# Altium schematic sheet Feedback_Controller_Buck.SchDoc: Buck Converter 20V 60W
size A4; Date: 25 FEB 2024; Author: Arturo S. Bayangos; Revision: V.10; SheetNumber: 3; SheetTotal: 4
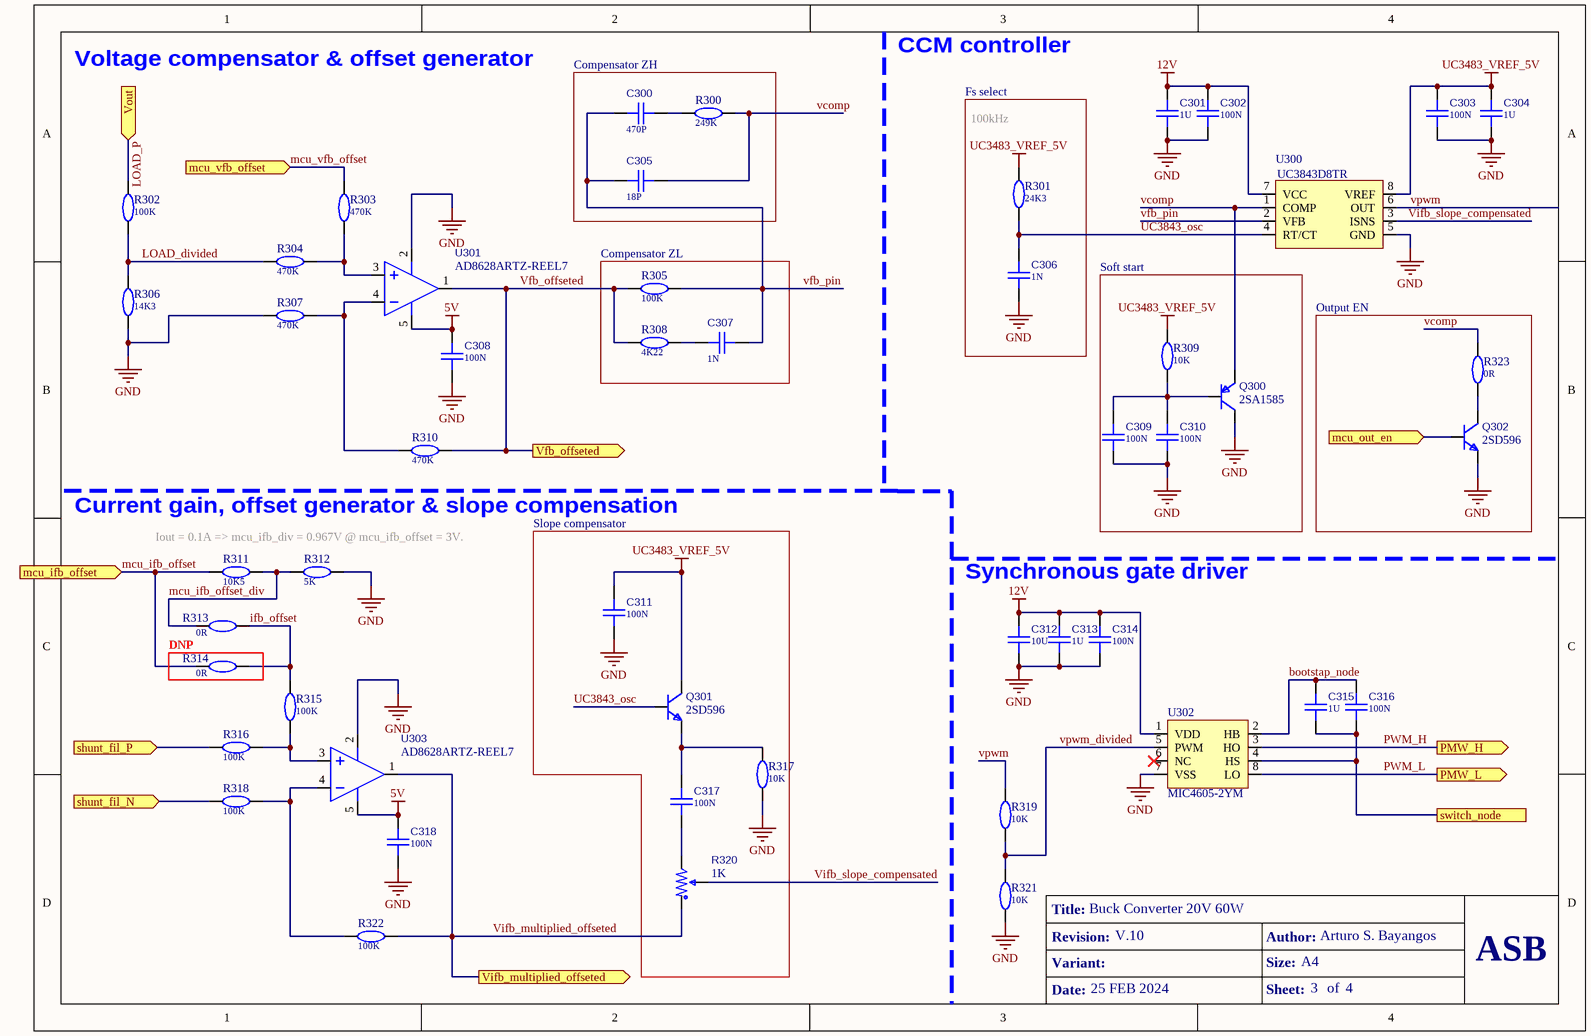
[diagram p0: Feedback_Controller_Buck.SchDoc]

## Parts
C300  value 470P  [CAP_0603]  (hidden comment: CAPACITOR)
C301  value 1U  [CAP_0603]  (hidden comment: CAPACITOR)
C302  value 100N  [CAP_0402]  (hidden comment: CAPACITOR)
C303  value 100N  [CAP_0402]  (hidden comment: CAPACITOR)
C304  value 1U  [CAP_0603]  (hidden comment: CAPACITOR)
C305  value 18P  [CAP_0603]  (hidden comment: CAPACITOR)
C306  value 1N  [CAP_0603]  (hidden comment: CAPACITOR)
C307  value 1N  [CAP_0603]  (hidden comment: CAPACITOR)
C308  value 100N  [CAP_0402]  (hidden comment: CAPACITOR)
C309  value 100N  [CAP_0402]  (hidden comment: CAPACITOR)
C310  value 100N  [CAP_0402]  (hidden comment: CAPACITOR)
C311  value 100N  [CAP_0402]  (hidden comment: CAPACITOR)
C312  value 10U  [CAP_1210]  (hidden comment: CAPACITOR)
C313  value 1U  [CAP_0603]  (hidden comment: CAPACITOR)
C314  value 100N  [CAP_0402]  (hidden comment: CAPACITOR)
C315  value 1U  [CAP_0603]  (hidden comment: CAPACITOR)
C316  value 100N  [CAP_0402]  (hidden comment: CAPACITOR)
C317  value 100N  [CAP_0402]  (hidden comment: CAPACITOR)
C318  value 100N  [CAP_0402]  (hidden comment: CAPACITOR)
Q300  value 2SA1585  [SOT-23]  (hidden comment: BJT_PNP)
Q301  value 2SD596  [SOT-23]  (hidden comment: BJT_NPN)
Q302  value 2SD596  [SOT-23]  (hidden comment: BJT_NPN)
R300  value 249K  [RES_0603]  (hidden comment: RESISTOR)
R301  value 24K3  [RES_0603]  (hidden comment: RESISTOR)
R302  value 100K  [RES_0603]  (hidden comment: RESISTOR)
R303  value 470K  [RES_0603]  (hidden comment: RESISTOR)
R304  value 470K  [RES_0603]  (hidden comment: RESISTOR)
R305  value 100K  [RES_0603]  (hidden comment: RESISTOR)
R306  value 14K3  [RES_0603]  (hidden comment: RESISTOR)
R307  value 470K  [RES_0603]  (hidden comment: RESISTOR)
R308  value 4K22  [RES_0603]  (hidden comment: RESISTOR)
R309  value 10K  [RES_0603]  (hidden comment: RESISTOR)
R310  value 470K  [RES_0603]  (hidden comment: RESISTOR)
R311  value 10K5  [RES_0402]  (hidden comment: RESISTOR)
R312  value 5K  [RES_0402]  (hidden comment: RESISTOR)
R313  value 0R  [RES_0402]  (hidden comment: RESISTOR)
R314  value 0R  [RES_0402]  (hidden comment: RESISTOR)
R315  value 100K  [RES_0603]  (hidden comment: RESISTOR)
R316  value 100K  [RES_0603]  (hidden comment: RESISTOR)
R317  value 10K  [RES_0603]  (hidden comment: RESISTOR)
R318  value 100K  [RES_0603]  (hidden comment: RESISTOR)
R319  value 10K  [RES_0603]  (hidden comment: RESISTOR)
R320  value 1K  [RES_GF063P1-B102]  (hidden comment: RESISTOR_POT)
R321  value 10K  [RES_0603]  (hidden comment: RESISTOR)
R322  value 100K  [RES_0603]  (hidden comment: RESISTOR)
R323  value 0R  [RES_0402]  (hidden comment: RESISTOR)
U300  value UC3843D8TR  [SOIC-8]  (hidden comment: PWM-CONTROLLER_8P)
U301  value AD8628ARTZ-REEL7  [SOT-23-5]  (hidden comment: OPAMP_1)
U302  value MIC4605-2YM  [SOIC-8]  (hidden comment: GATEDRIVE_8P_SINGLE-PWM)
U303  value AD8628ARTZ-REEL7  [SOT-23-5]  (hidden comment: OPAMP_1)

## Blocks framed on the sheet
Compensator ZH: C300 C305 R300
Compensator ZL: C307 R305 R308
Soft start: C309 C310 Q300 R309
Output EN: Q302 R323
Slope compensator: C311 C317 Q301 R317 R320

## Ports
mcu_ifb_offset (in), mcu_out_en (in), mcu_vfb_offset (in), PMW_H (out), PMW_L (out), shunt_fil_N (in), shunt_fil_P (in), switch_node, Vfb_offseted (out), Vifb_multiplied_offseted (out), Vout (in)

## Nets
5V: C308.2 C318.2 U301.5(+V) U303.5(+V)
12V: C301.2 C302.2 C312.2 C313.1 C314.2 U300.7(VCC) U302.1(VDD)
GND: C301.1 C302.1 C303.1 C304.1 C306.2 C308.1 C309.1 C310.1 C311.1 C312.1 C313.2 C314.1 C318.1 Q300.3(C) Q302.2(E) R306.1 R307.1 R312.2 R317.1 R321.1 U300.5(GND) U301.2(-V) U302.7(VSS) U303.2(-V)
UC3483_VREF_5V: C303.2 C304.2 C311.2 Q301.3(C) R301.2 R309.2 U300.8(VREF)
bootstap_node: C315.2 C316.1 U302.2(HB)
ifb_offset: R313.2 R314.2 R315.2
LOAD_divided: R302.1 R304.1 R306.2
LOAD_P: R302.2 ; port Vout
mcu_ifb_offset: R311.1 R314.1 ; port mcu_ifb_offset
mcu_ifb_offset_div: R311.2 R312.1 R313.1
mcu_out_en: Q302.1(B) ; port mcu_out_en
mcu_vfb_offset: R303.2 ; port mcu_vfb_offset
PWM_H: U302.3(HO) ; port PMW_H
PWM_L: U302.8(LO) ; port PMW_L
shunt_fil_N: R318.1 ; port shunt_fil_N
shunt_fil_P: R316.1 ; port shunt_fil_P
switch_node: C315.1 C316.2 U302.4(HS) ; port switch_node
UC3843_osc: C306.1 Q301.1(B) R301.1 U300.4(RT/CT)
vcomp: C305.2 Q300.2(E) R300.2 R323.2 U300.1(COMP)
Vfb_offseted: R305.1 R308.1 R310.2 U301.1(OUT) ; port Vfb_offseted
vfb_pin: C300.1 C305.1 C307.2 R305.2 U300.2(VFB)
Vifb_multiplied_offseted: R320.1 R322.2 U303.1(OUT) ; port Vifb_multiplied_offseted
Vifb_slope_compensated: R320.2 U300.3(ISNS)
vpwm: R319.2 U300.6(OUT)
vpwm_divided: R319.1 R321.2 U302.5(PWM)
NetC300_2: C300.2 R300.1
NetC307_1: C307.1 R308.2
NetC309_2: C309.2 C310.2 Q300.1(B) R309.1
NetC317_1: C317.1 R320.3
NetC317_2: C317.2 Q301.2(E) R317.2
NetQ302_3: Q302.3(C) R323.1
NetR303_1: R303.1 R304.2 U301.3(+IN)
NetR307_2: R307.2 R310.1 U301.4(-IN)
NetR315_1: R315.1 R316.2 U303.3(+IN)
NetR318_2: R318.2 R322.1 U303.4(-IN)

Not connected (* = marked no-connect by the designer): U302 6(NC)*

## Notes on the sheet
- Voltage compensator & offset generator
- CCM controller
- Fs select
- 100kHz
- Current gain, offset generator & slope compensation
- Iout = 0.1A => mcu_ifb_div = 0.967V @ mcu_ifb_offset = 3V.
- Synchronous gate driver
- DNP
- Title:
- Revision:
- Variant:
- Size:
- Author:
- A4
- ASB
- Date:
- Sheet:
- of

## Library data of the parts
C300 = CC0603GRNPO9BN471: CAP 470P 0603 NPO 50V 2%; Manifacturer: YAGEO; Part Number: CC0603GRNPO9BN471; ComponentLink1Description: Datasheet; ComponentLink1URL: https://datasheet.lcsc.com/lcsc/2304140030_YAGEO-CC0603GRNPO9BN471_C327194.pdf; ComponentLink2Description: Characteristics; Package: 0603
C301 C304 C313 C315 = TMK107AB7105KAHT: CAP 1U 0603 X7R 25V 10%; Manifacturer: Taiyo Yuden; Part Number: TMK107AB7105KAHT; ComponentLink1Description: Datasheet; ComponentLink1URL: https://datasheet.lcsc.com/lcsc/1912111437_Taiyo-Yuden-TMK107AB7105KAHT_C386079.pdf; ComponentLink2Description: Characteristics; ComponentLink2URL: Datasheets\Capacitors\TMK107AB7105KAHT_TaiyoYuden.pdf; Package: 0603
C302 C303 C308-C311 C314 C316-C318 = UMK105B7104KV-FR: CAP 100N 0402 X7R 50V 10%; Manifacturer: Taiyo Yuden; Part Number: UMK105B7104KV-FR; ComponentLink1Description: Datasheet; ComponentLink1URL: https://datasheet.lcsc.com/lcsc/2211282030_Taiyo-Yuden-UMK105B7104KV-FR_C2167491.pdf; ComponentLink2Description: Characteristics; ComponentLink2URL: Datasheets\Capacitors\UMK105B7104KV-FR_TaiyoYuden.pdf; Package: 0402
C305 = CC0603JRNPO9BN180: CAP 18P 0603 NPO 50V 5%; Manifacturer: YAGEO; Part Number: CC0603JRNPO9BN180; ComponentLink1Description: Datasheet; ComponentLink1URL: https://datasheet.lcsc.com/lcsc/2304140030_YAGEO-CC0603JRNPO9BN180_C107040.pdf; ComponentLink2Description: Characteristics; Package: 0603
C306 C307 = CC0603GRNPO8BN102: CAP 1N 0603 NPO 25V 2%; Manifacturer: YAGEO; Part Number: CC0603GRNPO8BN102; ComponentLink1Description: Datasheet; ComponentLink1URL: https://datasheet.lcsc.com/lcsc/2005181835_YAGEO-CC0603GRNPO8BN102_C519480.pdf; ComponentLink2Description: Characteristics; Package: 0603
C312 = UMK325AB7106KM-T: CAP 10U 1210 X7R 50V 10%; Manifacturer: Taiyo Yuden; Part Number: UMK325AB7106KM-T; ComponentLink1Description: Datasheet; ComponentLink1URL: https://datasheet.lcsc.com/lcsc/2211282230_Taiyo-Yuden-UMK325AB7106KM-T_C386167.pdf; ComponentLink2Description: Characteristics; ComponentLink2URL: Datasheets\Capacitors\UMK325AB7106KM-T_TaiyoYuden_Char.pdf; Package: 1210
Q300 = 2SA1585: PNP 2SA1585 SOT-23 20V 0.35W; VEBO: 6V; Tjmax: 150 °C; Manifacturer: Jiangsu Changjing Electronics Technology Co., Ltd.; Part Number: 2SA1585; Package: SOT-23; VCEO: 20V; Power: 0.35W; ComponentLink1Description: Datasheet; ComponentLink1URL: https://datasheet.lcsc.com/lcsc/1810010514_Jiangsu-Changjing-Electronics-Technology-Co---Ltd--2SA1585_C92477.pdf; ComponentLink2Description: Characteristics
Q301 Q302 = 2SD596: NPN 2SD596 SOT-23 25V 0.2W; VEBO: 5V; Tjmax: 150 °C; Manifacturer: YONGYUTAI; ComponentLink1Description: Datasheet; ComponentLink1URL: https://datasheet.lcsc.com/lcsc/2109011130_YONGYUTAI-2SD596_C2891824.pdf; Part Number: 2SD596; Package: SOT-23; VCEO: 25V; Power: 0.2W
R300 = FRC0603F2493TS: RES 249K 0603 1% 0.1W 75V; Manifacturer: FOJAN; Part Number: FRC0603F2493TS; ComponentLink1Description: Datasheet; ComponentLink1URL: https://datasheet.lcsc.com/lcsc/2308241103_FOJAN-FRC0603F2493TS_C2933177.pdf; ComponentLink2Description: Characteristics; Package: 0603
R301 = WF06H2432BTL: RES 24K3 0603 0.1% 0.1W 50V; Manifacturer: Walsin Tech Corp; Part Number: WF06H2432BTL; ComponentLink1Description: Datasheet; ComponentLink1URL: https://datasheet.lcsc.com/lcsc/2207151730_Walsin-Tech-Corp-WF06H2432BTL_C4354966.pdf; ComponentLink2Description: Characteristics; Package: 0603
R302 R305 R315 R316 R318 R322 = RC0603FR-07100KL: RES 100K 0603 1% 0.1W 75V; Manifacturer: YAGEO; Part Number: RC0603FR-07100KL; ComponentLink1Description: Datasheet; ComponentLink1URL: https://datasheet.lcsc.com/lcsc/1809281124_YAGEO-RC0603FR-07100KL_C14675.pdf; ComponentLink2Description: Characteristics; Package: 0603
R303 R304 R307 R310 = 0603WAF4703T5E: RES 470K 0603 1% 0.1W 75V; Manifacturer: UNI-ROYAL; Part Number: 0603WAF4703T5E; ComponentLink1Description: Datasheet; ComponentLink1URL: https://datasheet.lcsc.com/lcsc/2206010116_UNI-ROYAL-Uniroyal-Elec-0603WAF4703T5E_C23178.pdf; ComponentLink2Description: Characteristics; Package: 0603
R306 = RT0603BRE0714K3L: RES 14K3 0603 1% 0.1W 75V; Manifacturer: YAGEO; Part Number: RT0603BRE0714K3L; ComponentLink1Description: Datasheet; ComponentLink1URL: https://datasheet.lcsc.com/lcsc/2009282136_YAGEO-RT0603BRE0714K3L_C705810.pdf; ComponentLink2Description: Characteristics; Package: 0603
R308 = CRCW06034K22FKEA: RES 4K22 0603 1% 0.1W 75V; Manifacturer: Vishay Intertech; Part Number: CRCW06034K22FKEA; ComponentLink1Description: Datasheet; ComponentLink1URL: https://datasheet.lcsc.com/lcsc/2304140030_Vishay-Intertech-CRCW06034K22FKEA_C843958.pdf; ComponentLink2Description: Characteristics; Package: 0603
R309 R317 R319 R321 = ARG03BTC1002: RES 10K 0603 0.1W 0.1% 75V; Manifacturer: Viking Tech; Part Number: ARG03BTC1002; ComponentLink1Description: Datasheet; ComponentLink1URL: Datasheets\Resistors\ARG03BTC1002_VikingTech.pdf; ComponentLink2Description: Characteristics; Package: 0603
R311 = TC0250B1052TCC: RES 10K5 0402 0.1% 0.625W 25V; Manifacturer: UNI-ROYAL(Uniroyal Elec); Part Number: TC0250B1052TCC; ComponentLink1Description: Datasheet; ComponentLink1URL: https://datasheet.lcsc.com/lcsc/2304140030_UNI-ROYAL-Uniroyal-Elec-TC0250B1052TCC_C517521.pdf; Package: 0402
R312 = AR02BTC5001: RES 5K 0402 0.1% 0.63W; Manifacturer: Viking Tech; Part Number: AR02BTC5001; ComponentLink1Description: Datasheet; ComponentLink1URL: https://datasheet.lcsc.com/lcsc/2311271515_Viking-Tech-AR02BTC5001_C5948099.pdf; Package: 0402
R313 R314 R323 = 0402WGF0000TCE: RES 0R 0402 1% 0.625W; Manifacturer: UNI-ROYAL(Uniroyal Elec); Part Number: 0402WGF0000TCE; ComponentLink1Description: Datasheet; ComponentLink1URL: https://datasheet.lcsc.com/lcsc/2206010216_UNI-ROYAL-Uniroyal-Elec-0402WGF0000TCE_C17168.pdf; Package: 0402
R320 = GF063P1-B102: RES POT 1K TH 20%; Manifacturer: Tokyo Cosmos Elec; ComponentLink1Description: Datasheet; ComponentLink1URL: https://datasheet.lcsc.com/lcsc/2304140030_Tokyo-Cosmos-Elec-GF063P1-B102_C128078.pdf; ComponentLink2Description: Characteristics; Part Number: GF063P1-B102; Package: TH
U300 = UC3843D8TR: IC UC3843D8TR SOIC-8 PWM-CONTROLLER; Supply Voltage: 30V; Tj: 150 ℃; Manifacturer: Texas Instruments; Part Number: UC3843D8TR; Package: SOIC-8; Type: PWM-CONTROLLER; ComponentLink1Description: Datasheet; ComponentLink1URL: https://www.ti.com/lit/ds/symlink/uc3842.pdf?HQS=dis-dk-null-digikeymode-dsf-pf-null-wwe&ts=1707097391176; ComponentLink2Description: Characteristics
U301 U303 = AD8628ARTZ-REEL7: OPAMP AD8628ARTZ-REEL7 SOT-23-5 2.5MHz; Voltage - Input Offset(Vos): 1uV; Current - Input Bias(Ib): 30pA; Number of Circuits: 1; Supply Voltage: 6V; Manifacturer: Analog Devices; ComponentLink1Description: Datasheet; ComponentLink1URL: https://datasheet.lcsc.com/lcsc/1811091710_Analog-Devices-AD8628ARTZ-REEL7_C29309.pdf; ComponentLink2Description: Characteristics; Part Number: AD8628ARTZ-REEL7; Package: SOT-23-5; Gain Bandwidth Product(GBP): 2.5MHz; Operating Temperature: -40℃~+125℃
U302 = MIC4605-2YM: GATEDRVR MIC4605-2YM SOIC-8 HALF-BRIDGE  5.5V-16V; Tj: 125℃; Low-Level Input Voltage (min): 0.8V; High-Level Input Voltage (max): 2.2V; Propagation delay (max): 75ns; Manifacturer: Microchip Tech; Part Number: MIC4605-2YM; Package: SOIC-8; Type: HALF-BRIDGE; Supply Voltage: 5.5V-16V; ComponentLink1Description: Datasheet; ComponentLink1URL: https://datasheet.lcsc.com/lcsc/2309071225_Microchip-Tech-MIC4605-2YM_C637550.pdf; ComponentLink2Description: Characteristics